# EAGLE design arrayboard_r1 (EAGLE 6.5.0)
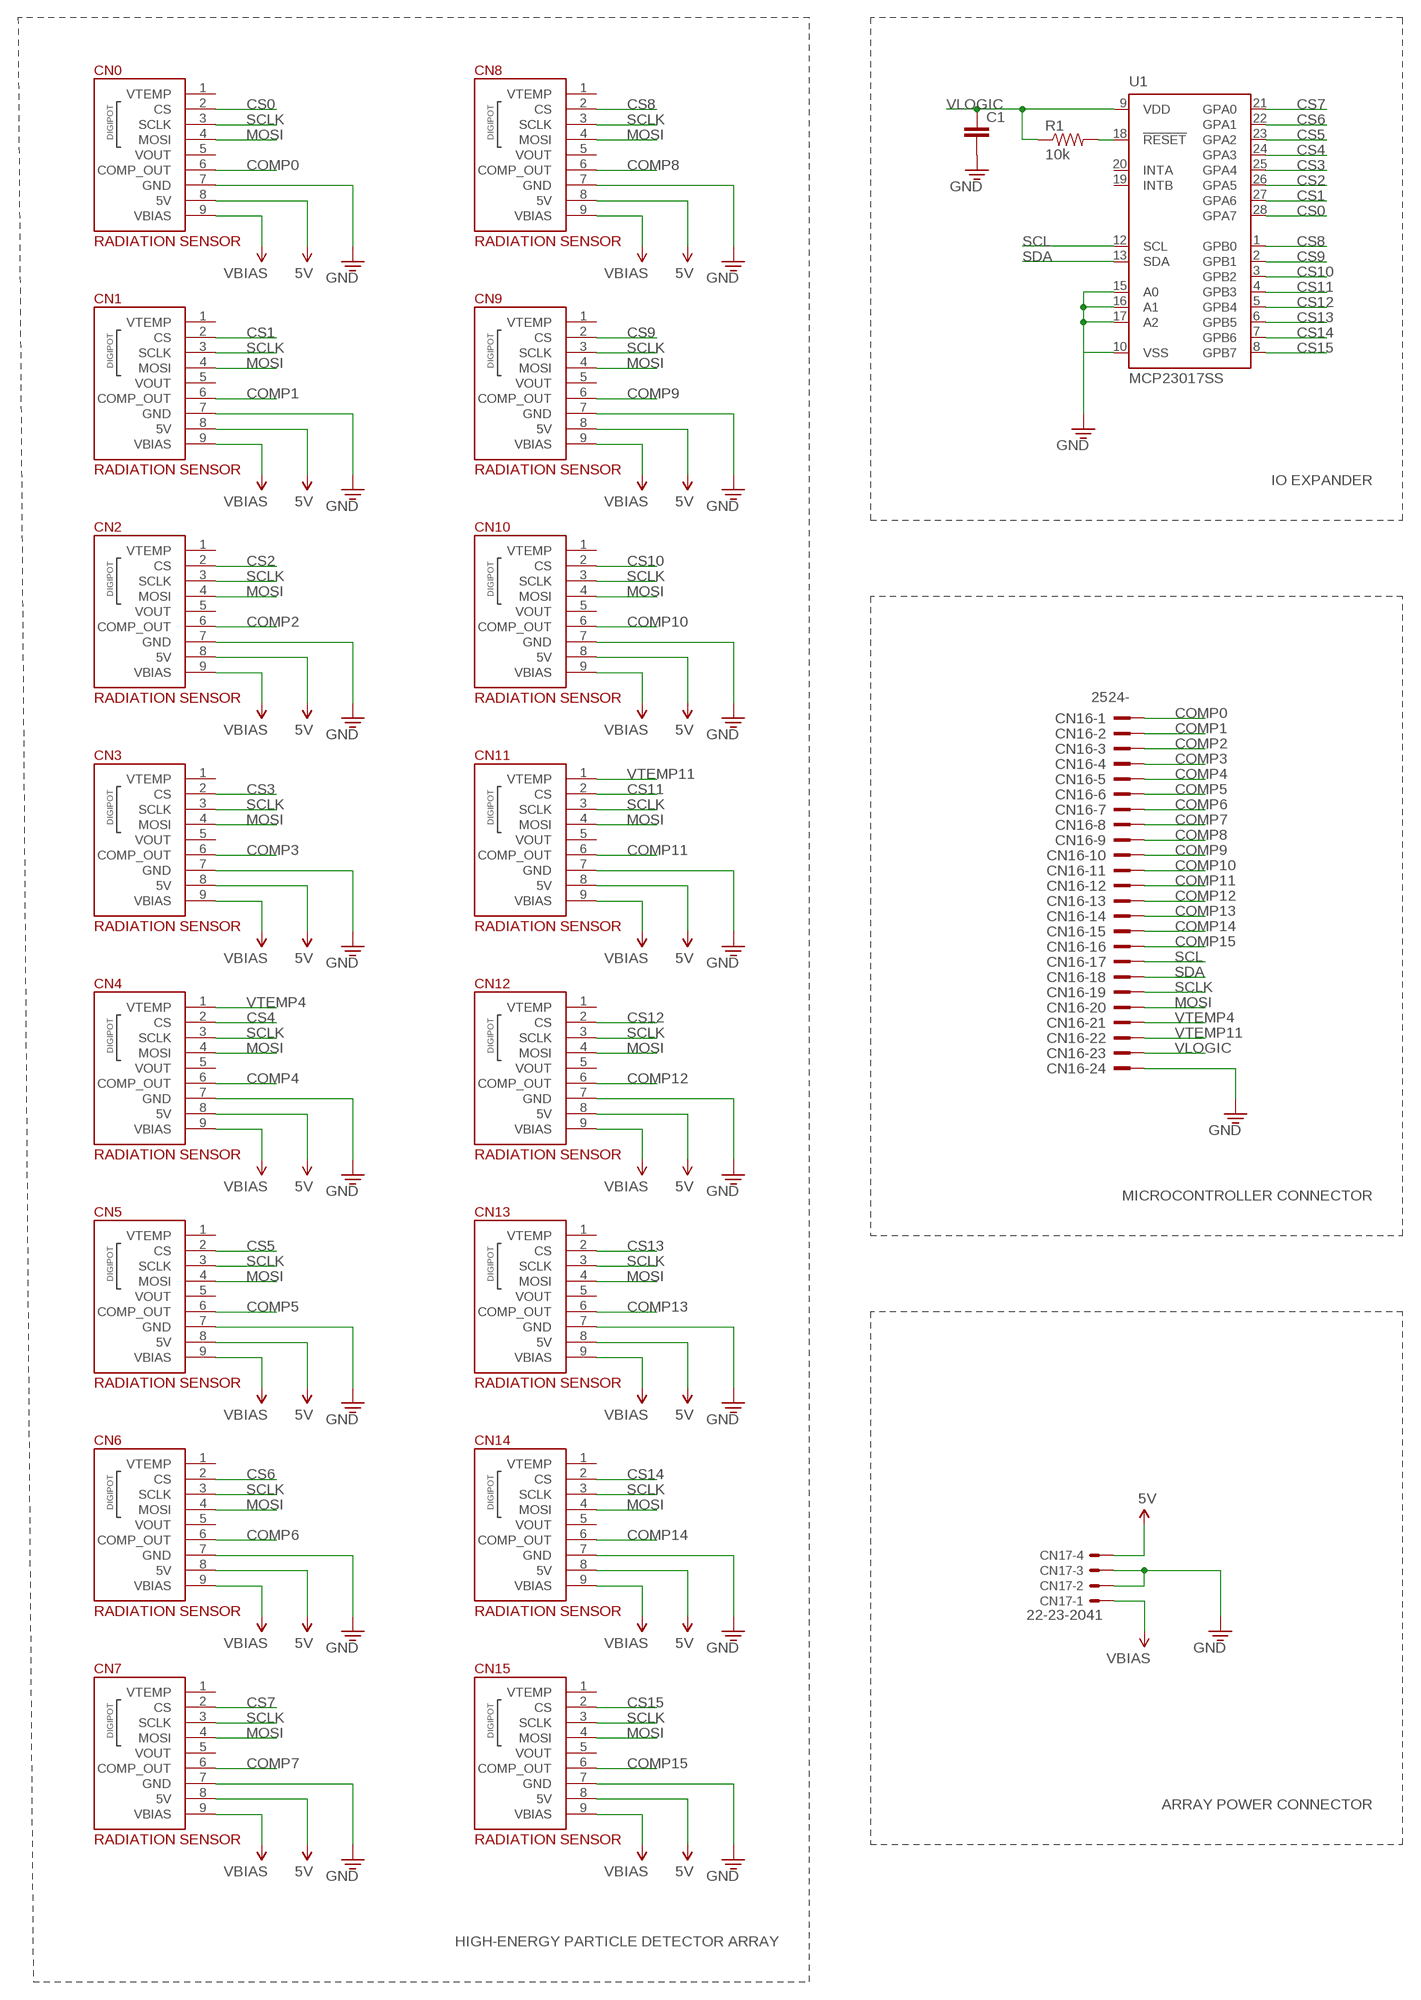
[diagram p0: schematic, sheet 1]

## Parts
C1  CAP0603  [0603]
CN0  RADIATION-SENSOR-REV1  [RADIATION-SENSOR-REV1]
CN1  RADIATION-SENSOR-REV1  [RADIATION-SENSOR-REV1]
CN2  RADIATION-SENSOR-REV1  [RADIATION-SENSOR-REV1]
CN3  RADIATION-SENSOR-REV1  [RADIATION-SENSOR-REV1]
CN4  RADIATION-SENSOR-REV1  [RADIATION-SENSOR-REV1]
CN5  RADIATION-SENSOR-REV1  [RADIATION-SENSOR-REV1]
CN6  RADIATION-SENSOR-REV1  [RADIATION-SENSOR-REV1]
CN7  RADIATION-SENSOR-REV1  [RADIATION-SENSOR-REV1]
CN8  RADIATION-SENSOR-REV1  [RADIATION-SENSOR-REV1]
CN9  RADIATION-SENSOR-REV1  [RADIATION-SENSOR-REV1]
CN10  RADIATION-SENSOR-REV1  [RADIATION-SENSOR-REV1]
CN11  RADIATION-SENSOR-REV1  [RADIATION-SENSOR-REV1]
CN12  RADIATION-SENSOR-REV1  [RADIATION-SENSOR-REV1]
CN13  RADIATION-SENSOR-REV1  [RADIATION-SENSOR-REV1]
CN14  RADIATION-SENSOR-REV1  [RADIATION-SENSOR-REV1]
CN15  RADIATION-SENSOR-REV1  [RADIATION-SENSOR-REV1]
CN16  2524-  [PAK100/2500-24]
CN17  22-23-2041  [22-23-2041]
R1  10k  RESISTOR0603  [0603]
U1  MCP23017SS  [SSOP28]

## Nets
5V: CN0.8(5V) CN1.8(5V) CN2.8(5V) CN3.8(5V) CN4.8(5V) CN5.8(5V) CN6.8(5V) CN7.8(5V) CN8.8(5V) CN9.8(5V) CN10.8(5V) CN11.8(5V) CN12.8(5V) CN13.8(5V) CN14.8(5V) CN15.8(5V) CN17.4
COMP0: CN0.6(COMP_OUT) CN16.1
COMP1: CN1.6(COMP_OUT) CN16.2
COMP2: CN2.6(COMP_OUT) CN16.3
COMP3: CN3.6(COMP_OUT) CN16.4
COMP4: CN4.6(COMP_OUT) CN16.5
COMP5: CN5.6(COMP_OUT) CN16.6
COMP6: CN6.6(COMP_OUT) CN16.7
COMP7: CN7.6(COMP_OUT) CN16.8
COMP8: CN8.6(COMP_OUT) CN16.9
COMP9: CN9.6(COMP_OUT) CN16.10
COMP10: CN10.6(COMP_OUT) CN16.11
COMP11: CN11.6(COMP_OUT) CN16.12
COMP12: CN12.6(COMP_OUT) CN16.13
COMP13: CN13.6(COMP_OUT) CN16.14
COMP14: CN14.6(COMP_OUT) CN16.15
COMP15: CN15.6(COMP_OUT) CN16.16
CS0: CN0.2(CS) U1.28(GPA7)
CS1: CN1.2(CS) U1.27(GPA6)
CS2: CN2.2(CS) U1.26(GPA5)
CS3: CN3.2(CS) U1.25(GPA4)
CS4: CN4.2(CS) U1.24(GPA3)
CS5: CN5.2(CS) U1.23(GPA2)
CS6: CN6.2(CS) U1.22(GPA1)
CS7: CN7.2(CS) U1.21(GPA0)
CS8: CN8.2(CS) U1.1(GPB0)
CS9: CN9.2(CS) U1.2(GPB1)
CS10: CN10.2(CS) U1.3(GPB2)
CS11: CN11.2(CS) U1.4(GPB3)
CS12: CN12.2(CS) U1.5(GPB4)
CS13: CN13.2(CS) U1.6(GPB5)
CS14: CN14.2(CS) U1.7(GPB6)
CS15: CN15.2(CS) U1.8(GPB7)
GND: C1.2 CN0.7(GND) CN1.7(GND) CN2.7(GND) CN3.7(GND) CN4.7(GND) CN5.7(GND) CN6.7(GND) CN7.7(GND) CN8.7(GND) CN9.7(GND) CN10.7(GND) CN11.7(GND) CN12.7(GND) CN13.7(GND) CN14.7(GND) CN15.7(GND) CN16.24 CN17.2 CN17.3 U1.10(VSS) U1.15(A0) U1.16(A1) U1.17(A2)
MOSI: CN0.4(MOSI) CN1.4(MOSI) CN2.4(MOSI) CN3.4(MOSI) CN4.4(MOSI) CN5.4(MOSI) CN6.4(MOSI) CN7.4(MOSI) CN8.4(MOSI) CN9.4(MOSI) CN10.4(MOSI) CN11.4(MOSI) CN12.4(MOSI) CN13.4(MOSI) CN14.4(MOSI) CN15.4(MOSI) CN16.20
N$2: R1.2 U1.18(!RESET)
SCL: CN16.17 U1.12(SCL)
SCLK: CN0.3(SCLK) CN1.3(SCLK) CN2.3(SCLK) CN3.3(SCLK) CN4.3(SCLK) CN5.3(SCLK) CN6.3(SCLK) CN7.3(SCLK) CN8.3(SCLK) CN9.3(SCLK) CN10.3(SCLK) CN11.3(SCLK) CN12.3(SCLK) CN13.3(SCLK) CN14.3(SCLK) CN15.3(SCLK) CN16.19
SDA: CN16.18 U1.13(SDA)
VBIAS: CN0.9(VBIAS) CN1.9(VBIAS) CN2.9(VBIAS) CN3.9(VBIAS) CN4.9(VBIAS) CN5.9(VBIAS) CN6.9(VBIAS) CN7.9(VBIAS) CN8.9(VBIAS) CN9.9(VBIAS) CN10.9(VBIAS) CN11.9(VBIAS) CN12.9(VBIAS) CN13.9(VBIAS) CN14.9(VBIAS) CN15.9(VBIAS) CN17.1
VLOGIC: C1.1 CN16.23 R1.1 U1.9(VDD)
VTEMP4: CN4.1(VTEMP) CN16.21
VTEMP11: CN11.1(VTEMP) CN16.22
Unconnected: CN0.1(VTEMP) CN0.5(VOUT) CN1.1(VTEMP) CN1.5(VOUT) CN2.1(VTEMP) CN2.5(VOUT) CN3.1(VTEMP) CN3.5(VOUT) CN4.5(VOUT) CN5.1(VTEMP) CN5.5(VOUT) CN6.1(VTEMP) CN6.5(VOUT) CN7.1(VTEMP) CN7.5(VOUT) CN8.1(VTEMP) CN8.5(VOUT) CN9.1(VTEMP) CN9.5(VOUT) CN10.1(VTEMP) CN10.5(VOUT) CN11.5(VOUT) CN12.1(VTEMP) CN12.5(VOUT) CN13.1(VTEMP) CN13.5(VOUT) CN14.1(VTEMP) CN14.5(VOUT) CN15.1(VTEMP) CN15.5(VOUT) U1.19(INTB) U1.20(INTA)

## Notes on the sheet
- IO EXPANDER
- MICROCONTROLLER CONNECTOR
- ARRAY POWER CONNECTOR
- HIGH-ENERGY PARTICLE DETECTOR ARRAY

## Library data of the parts
C1 = openct:CAP: Capacitor Standard 0603 ceramic capacitor, and 0.1" leaded capacitor.
CN0 CN1-CN15 = openct:RADIATION-SENSOR-REV1: Header for Radiation Sensor (rev1)
CN16 = con-3m:2524-: 3M (TM) Pak 100 4-Wall Header Source: 3M; OC_FARNELL: unknown; OC_NEWARK: unknown
CN17 = con-molex:22-23-2041: .100" (2.54mm) Center Header - 4 Pin; MF: MOLEX; MPN: 22-23-2041; OC_FARNELL: 1462920; OC_NEWARK: 38C0355
R1 = openct:RESISTOR: Resistor Basic schematic elements and footprints for 0603, 1206, and PTH 1/10th watt (small) resistors.
U1 = adafruit:MCP23017: http://ww1.microchip.com/downloads/en/DeviceDoc/21952a.pdf Source: http://ww1.microchip.com/downloads/en/DeviceDoc/21952a.pdf

## Board
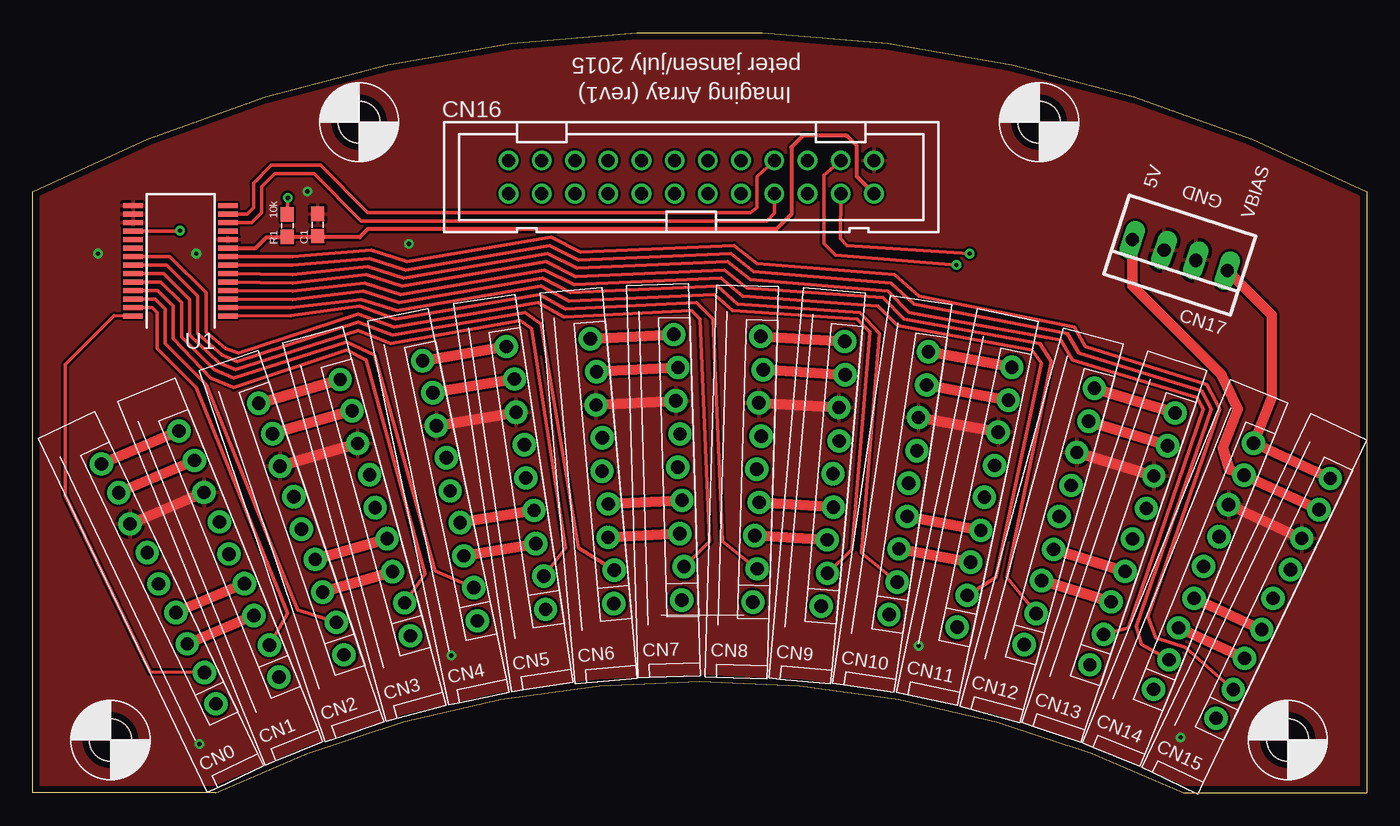
[diagram p1: board, top side]
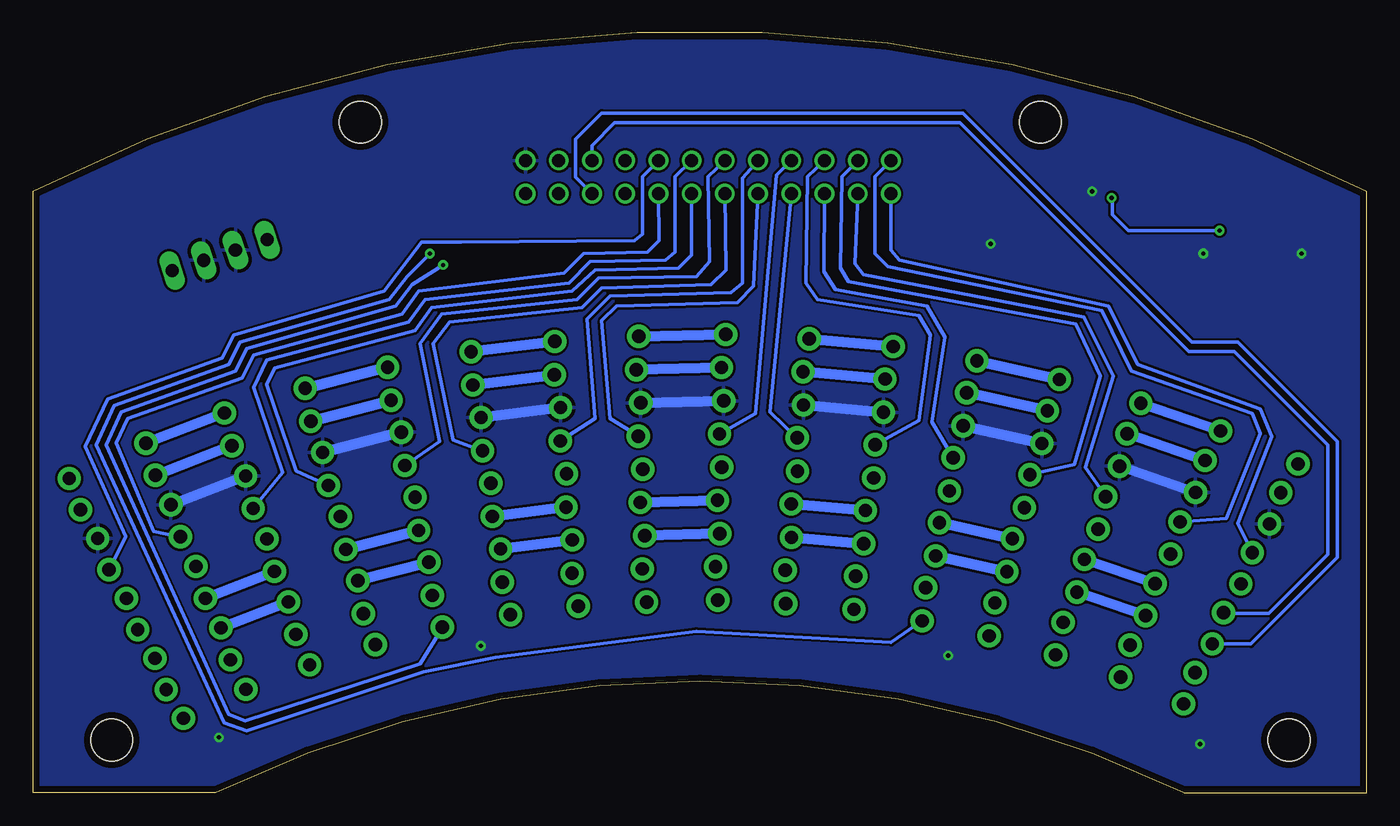
[diagram p2: board, bottom side, seen from below]

Size 102 x 58.14 mm. Coordinates in mm from the lower left corner, seen from the top.
Outline: 102,46 102,0 88,0 arc52 14,0 0,0 0,46 arc-54 102,46
Copper layers (1*16): Top 0.035mm / dielectric 1.5mm / Bottom 0.035mm
Design rules "default *": minimum track width 7mil, minimum drill 13mil, track to track 7mil, track to pad 8mil, pad to pad 8mil, via to via 8mil, smd to smd 8mil, copper to edge 20mil, drill to drill 8mil, minimum pad ring 10mil, minimum via ring 8mil, stop-mask expansion 4mil, vias tented up to drill 0mil, thermal gap 10mil

### Footprints (pad centres in the part's own frame; a part is rotated, then mirrored left to right if it is on the bottom)
0603 = smd 1.1 x 1: 1 -0.85,0; 2 0.85,0
RADIATION-SENSOR-REV1 = drill 1.016 pad 1.778: 1 9.16,1.123; 2 6.62,1.377; 3 4.08,1.123; 4 1.54,1.377; 5 -1,1.123; 6 -3.54,1.377; 7 -6.08,1.123; 8 -8.62,1.377; 9 -11.16,1.123
PAK100/2500-24 = drill 1 pad 1.422: 1 -13.97,-1.27; 2 -13.97,1.27; 3 -11.43,-1.27; 4 -11.43,1.27; 5 -8.89,-1.27; 6 -8.89,1.27; 7 -6.35,-1.27; 8 -6.35,1.27; 9 -3.81,-1.27; 10 -3.81,1.27; 11 -1.27,-1.27; 12 -1.27,1.27; 13 1.27,-1.27; 14 1.27,1.27; 15 3.81,-1.27; 16 3.81,1.27; 17 6.35,-1.27; 18 6.35,1.27; 19 8.89,-1.27; 20 8.89,1.27; 21 11.43,-1.27; 22 11.43,1.27; 23 13.97,-1.27; 24 13.97,1.27
22-23-2041 = drill 1 long: 1 -3.81,0; 2 -1.27,0; 3 1.27,0; 4 3.81,0
SSOP28 = smd 0.4 x 1.5: 1 -4.225,-3.625; 2 -3.575,-3.625; 3 -2.925,-3.625; 4 -2.275,-3.625; 5 -1.625,-3.625; 6 -0.975,-3.625; 7 -0.325,-3.625; 8 0.325,-3.625; 9 0.975,-3.625; 10 1.625,-3.625; 11 2.275,-3.625; 12 2.925,-3.625; 13 3.575,-3.625; 14 4.225,-3.625; 15 4.225,3.625; 16 3.575,3.625; 17 2.925,3.625; 18 2.275,3.625; 19 1.625,3.625; 20 0.975,3.625; 21 0.325,3.625; 22 -0.325,3.625; 23 -0.975,3.625; 24 -1.625,3.625; 25 -2.275,3.625; 26 -2.925,3.625; 27 -3.575,3.625; 28 -4.225,3.625
MOUNT-M3 = hole 3.2: 0,0

### Placement (x,y rotation side)
C1  21.79,43.44 90 top
CN0  9.04,14.6 295.5 top
CN1  14.34,16.92 292.1 top
CN2  19.8,18.87 288.7 top
CN3  25.36,20.56 285.3 top
CN4  31.02,21.89 281.9 top
CN5  36.75,22.93 278.5 top
CN6  42.5,23.51 275.1 top
CN7  48.22,23.88 271.7 top
CN8  54.21,23.79 268.3 top
CN9  59.98,23.51 264.9 top
CN10  65.72,22.87 261.5 top
CN11  71.46,21.87 258.1 top
CN12  77.14,20.47 254.7 top
CN13  82.7,18.84 251.3 top
CN14  88.11,16.83 247.9 top
CN15  93.4,14.47 244.5 top
CN16  50.35,47.1 0 top
CN17  87.71,41.13 162 top
R1  19.47,43.39 90 top
U1  11.3,40.7 90 top
U$35  [MOUNT-M3]  76.95,51.3 0 top
U$36  [MOUNT-M3]  5.95,4.05 0 top
U$37  [MOUNT-M3]  95.95,4.05 0 top
U$38  [MOUNT-M3]  24.95,51.3 0 top

### Tracks (layer width: path | path; a pad name or v marks a point on that pad's centre or on a via)
5V
  Top 0.813: CN0.8 CN1.8 | CN2.8 CN3.8 | CN4.8 CN5.8 | CN6.8 CN7.8 | CN8.8 CN9.8 | CN10.8 CN11.8 | CN12.8 CN13.8 | CN15.8 CN14.8 91.5,24.75 91,26.38 92.12,29.38 90.88,32 84.08,38.79 CN17.4
  Bottom 0.813: CN1.8 CN2.8 | CN3.8 CN4.8 | CN5.8 CN6.8 | CN7.8 CN8.8 | CN9.8 CN10.8 | CN11.8 CN12.8 | CN13.8 CN14.8
COMP0
  Bottom 0.254: CN0.6 9.88,20.62 7.25,27.25 8.12,29.38 17.5,32.75 19.75,37.25 35.75,40.75 36.38,41.5 CN16.1
COMP1
  Bottom 0.254: CN1.6 10.75,21 8.12,27.5 8.75,29 18,32.25 20.25,36.88 36.62,40.25 37.62,41.25 37.62,47.12 CN16.2
COMP2
  Bottom 0.254: CN2.6 21.5,24.88 19.38,31.88 21.62,36.38 38.5,39.62 39.12,40.5 CN16.3
COMP3
  Bottom 0.254: CN3.6 22.38,25.12 20.38,31.88 22.25,35.88 39.62,39.12 40.25,40.12 40.12,47.12 CN16.4
COMP4
  Bottom 0.254: CN4.6 33.25,28.38 32.25,34.88 33.62,37.25 40.62,38.5 41.5,39.88 CN16.5
COMP5
  Bottom 0.254: CN5.6 34.25,28.5 33.38,35 34.25,36.5 42,37.75 42.88,39 42.75,47.12 CN16.6
COMP6
  Bottom 0.254: CN6.6 45.62,29.12 CN16.7
COMP7
  Bottom 0.254: CN7.6 46.75,29 45.12,47.25 CN16.8
COMP8
  Bottom 0.254: CN8.6 57.88,28.62 58.5,36.12 57.38,37.25 48.12,37.5 46.88,38.75 CN16.9
COMP9
  Bottom 0.254: CN9.6 59,28.62 59.62,36.25 57.88,38 48.62,38.25 47.75,39 47.75,47 CN16.10
COMP10
  Bottom 0.254: CN10.6 69.88,27 71.38,34.38 70.12,36 60,37.12 58.5,38.62 50.12,38.88 49,40 CN16.11
COMP11
  Bottom 0.254: CN11.6 70.88,26.88 72.38,34.38 70.75,36.62 60.38,37.75 58.75,39.38 51.25,39.5 50.25,40.62 50.38,47.12 CN16.12
COMP12
  Bottom 0.254: CN12.6 81.88,24.62 84.12,31.25 83.5,32.5 72.75,35.38 71.5,37.12 60.75,38.38 59,40 52.62,40.12 51.62,41.12 CN16.13
COMP13
  Bottom 0.254: CN13.6 82.88,24.5 85.12,31 84.12,33.12 73.25,36 72,37.75 61,39 59.38,40.62 53.62,40.75 52.88,41.38 52.88,47.12 CN16.14
COMP14
  Bottom 0.254: CN14.6 92.75,20 95.62,26.75 94.75,28.62 86,31.75 85.12,33.5 73.75,36.62 72.5,38.38 61.38,39.75 59.88,41.25 55,41.38 54.12,42.25 CN16.15
COMP15
  Bottom 0.254: CN15.6 94.88,19.62 98,26.5 96.25,30.12 87.5,33.25 86.62,35 75.12,38.38 72.25,42.12 69.25,42.12 56,42.25 55.38,42.75 55.38,47.12 CN16.16
CS0
  Top 0.254: CN0.2 9,9.25 2.5,22.75 2.5,32.75 6.25,36.5 U1.28
CS1
  Top 0.254: CN1.2 19.5,13.75 12.5,31 9.5,34 9.5,36.75 9.12,37.12 U1.27
CS2
  Top 0.254: CN2.2 20.25,14 13.25,31.25 10.12,34.38 10.12,37 9.35,37.78 U1.26
CS3
  Top 0.254: CN3.2 30,16.75 25.5,33.12 24,33.88 15.38,31 13.62,31.75 10.75,34.75 10.75,37.25 9.58,38.42 U1.25
CS4
  Top 0.254: CN4.2 30.75,17 26.12,33.5 24,34.5 15.38,31.75 13.88,32.38 11.38,34.88 11.38,37.5 9.8,39.08 U1.24
CS5
  Top 0.254: CN5.2 40.75,18.75 38.12,35.5 37.25,36.12 27.38,34.38 24.88,35.38 15.5,32.38 14.25,32.88 12,35 12,37.75 10.02,39.72 U1.23
CS6
  Top 0.254: CN6.2 41.75,18.75 38.88,35.88 37.62,36.75 27.5,35 24.88,36 15.62,33 14.5,33.5 12.62,35.12 12.62,38 10.25,40.38 U1.22
CS7
  Top 0.254: CN7.2 51.75,19.25 51,36.25 50.38,36.88 40.62,36.38 38.62,37.5 27.62,35.62 24.88,36.62 15.75,33.62 14.75,34 13.25,35.25 13.25,38.25 10.48,41.03 U1.21
CS8
  Top 0.254: CN8.2 52.75,19.25 52,36.25 50.75,37.5 40.75,37 38.75,38.12 27.75,36.25 25,37.25 19.75,36.5 U1.1
CS9
  Top 0.254: CN9.2 62.62,18.62 64,35.25 63,36.25 53.5,36.88 52.12,38.12 41,37.62 38.88,38.75 27.88,36.88 25.12,37.75 19.75,37.12 U1.2
CS10
  Top 0.254: CN10.2 63.38,18.38 64.75,35.12 63.25,36.75 53.88,37.38 52.38,38.75 41.12,38.25 39,39.38 28,37.5 25.25,38.38 19.88,37.75 U1.3
CS11
  Top 0.254: CN11.2 73.62,16.5 77.12,32.88 76.38,33.88 66.12,35.75 64.62,37.25 54.25,38 52.62,39.38 41.38,38.88 39.12,40 28.12,38.12 25.38,39 19.88,38.38 U1.4
CS12
  Top 0.254: CN12.2 74.5,16.5 77.88,33 77,34.38 66.62,36.25 65,37.88 54.62,38.62 52.88,40 41.5,39.5 39.25,40.62 28.25,38.75 25.5,39.62 19.88,39 U1.5
CS13
  Top 0.254: CN13.2 83.75,12.62 89.5,29.38 89,30.25 79.5,33.12 78.62,34.62 67,36.75 65.38,38.38 54.88,39.25 53.12,40.62 41.62,40.12 39.38,41.25 28.38,39.38 25.62,40.25 19.88,39.62 U1.6
CS14
  Top 0.254: CN14.2 84.75,11.38 84.38,12.75 90.12,29.38 89.38,30.75 80,33.62 79.12,35.12 67.38,37.38 65.62,39 55.12,39.88 53.38,41.25 41.75,40.75 39.5,41.88 28.5,40 25.75,40.88 19.88,40.38 U1.7
CS15
  Top 0.254: CN15.2 88.12,11.12 85.88,11.88 85.25,13.5 90.75,29.38 89.75,31.25 80.5,34.12 79.62,35.62 67.75,38 65.88,39.62 55.38,40.5 53.62,41.88 41.88,41.38 39.62,42.5 28.62,40.62 25.88,41.5 19.88,41 U1.8
GND  (via drill 0.33)
  Top 0.813: CN0.7 CN1.7 | CN2.7 CN3.7 | CN4.7 CN5.7 | CN6.7 CN7.7 | CN8.7 CN9.7 | CN10.7 CN11.7 | CN12.7 CN13.7 | CN14.7 CN15.7
  Bottom 0.813: CN1.7 CN2.7 | CN3.7 CN4.7 | CN5.7 CN6.7 | CN7.7 CN8.7 | CN9.7 CN10.7 | CN11.7 CN12.7 | CN13.7 CN14.7
  other vias: 21,46 12.5,41.25 5,41.25 28.75,42 12.75,3.75 67.75,11.25 87.75,4.25 32,10.5
  pour Bottom: 0,46 0,0 14,0 arc-52 88,0 102,0 102,46 arc54
  pour Top: 0,46 0,0 14,0 arc-52 88,0 102,0 102,46 arc54
MOSI
  Top 0.813: CN0.4 CN1.4 | CN2.4 CN3.4 | CN4.4 CN5.4 | CN6.4 CN7.4 | CN8.4 CN9.4 | CN10.4 CN11.4 | CN12.4 CN13.4 | CN14.4 CN15.4
  Bottom 0.254: CN16.20 59.24,49.51 57.5,51.25 31.12,51.25 13.62,33.75 10.12,33.75 3,26.62 3,18.25 7.5,13.75 10.9,13.75 CN0.4
  Bottom 0.813: CN1.4 CN2.4 | CN3.4 CN4.4 | CN5.4 CN6.4 | CN7.4 CN8.4 | CN9.4 CN10.4 | CN11.4 CN12.4 | CN13.4 CN14.4
N$2  (via drill 0.33)
  Top 0.254: U1.18 11.23,42.97 v11.25,43 | v19.5,45.5 19.5,44.27 R1.2
  Bottom 0.254: v11.25,43 18.23,43 R1.2 19.47,45.47 v19.5,45.5
SCL
  Top 0.254: CN16.17 56.7,44.33 56.12,43.75 25.12,43.75 21.5,47.38 18.5,47.38 17.5,46.38 17.5,44.38 16.75,43.62 U1.12
SCLK
  Top 0.813: CN0.3 CN1.3 | CN2.3 CN3.3 | CN4.3 CN5.3 | CN6.3 CN7.3 | CN8.3 CN9.3 | CN10.3 CN11.3 | CN12.3 CN13.3 | CN14.3 CN15.3
  Bottom 0.254: CN16.19 60.5,47.09 60.5,50 58.5,52 30.88,52 13.38,34.5 9.88,34.5 2.25,26.88 2.25,18 8.85,11.4 CN0.3
  Bottom 0.813: CN1.3 CN2.3 | CN3.3 CN4.3 | CN5.3 CN6.3 | CN7.3 CN8.3 | CN9.3 CN10.3 | CN11.3 CN12.3 | CN13.3 CN14.3
SDA
  Top 0.254: CN16.18 55.38,47.12 55.38,44.75 54.88,44.38 25.62,44.38 22,48 18.25,48 16.88,46.62 16.88,44.75 16.4,44.28 U1.13
VBIAS
  Top 0.813: CN0.9 CN1.9 | CN2.9 CN3.9 | CN4.9 CN5.9 | CN6.9 CN7.9 | CN8.9 CN9.9 | CN10.9 CN11.9 | CN12.9 CN13.9 | CN15.9 CN14.9 94.75,30.25 94.75,36.53 CN17.1
  Bottom 0.813: CN1.9 CN2.9 | CN3.9 CN4.9 | CN5.9 CN6.9 | CN7.9 CN8.9 | CN9.9 CN10.9 | CN11.9 CN12.9 | CN13.9 CN14.9
VLOGIC
  Top 0.305: CN16.23 63,47.15 63,49.5 62.25,50.25 58.88,50.25 58,49.38 58,44.25 56.88,43.12 25.62,43.12 25,42.5 21.12,42.5 C1.1 20.99,42.54 R1.1 18.93,42.5 17.88,42.5 17.05,41.67 U1.9
VTEMP4  (via drill 0.33)
  Top 0.254: v71.62,41.25 62.25,41.88 61.75,42.38 CN16.21
  Bottom 0.254: CN4.1 36.38,11.5 51.25,12.38 66.62,10.38 72.12,9.25 85.62,4.75 87.38,5.38 97.12,26.62 95.75,29.62 87,32.75 86.12,34.5 74.75,37.75 73.38,39.5 v71.62,41.25
VTEMP11  (via drill 0.33)
  Top 0.254: v70.62,40.38 61.38,41.12 60.5,42 60.5,47.25 CN16.22
  Bottom 0.254: CN11.1 72.38,9.88 85.75,5.5 87,6 96.38,26.62 95.25,29.12 86.5,32.25 85.62,34 74.25,37.25 73,38.88 v70.62,40.38

### Text on the board
tPlace: peter jansen/july 2015 | Imaging Array (rev1) | 5V | GND | VBIAS